# EAGLE design Telemetry receiver (EAGLE 8.0.1)
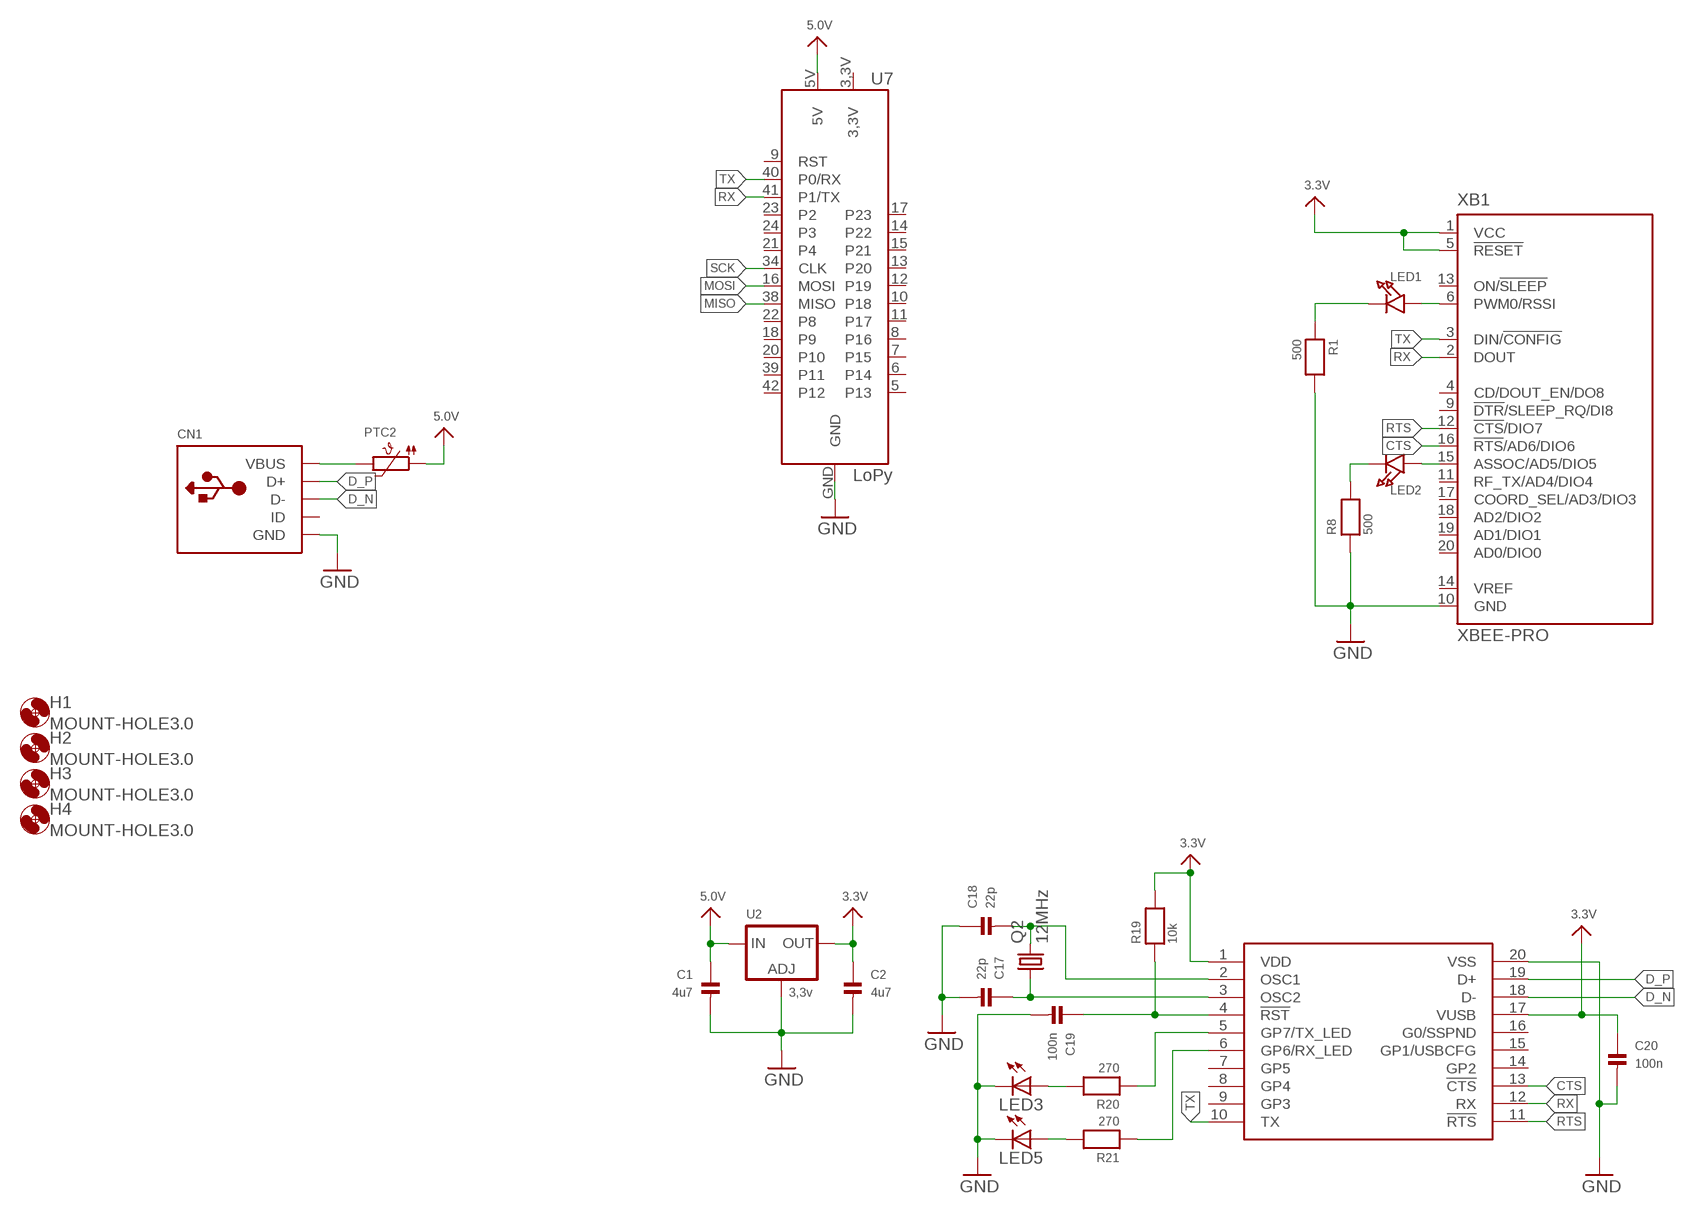
[diagram p0: schematic, sheet 1]

## Parts
C1  4u7  CAP_CERAMIC_0805  [_0805]
C2  4u7  CAP_CERAMIC_0805  [_0805]
C17  22p  CAP_CERAMIC_0603  [_0603]
C18  22p  CAP_CERAMIC_0603  [_0603]
C19  100n  CAP_CERAMIC_0603  [_0603]
C20  100n  CAP_CERAMIC_0603  [_0603]
CN1  USBMINIBLARGE  [USB-MINIB_LARGER]
H1  MOUNT-HOLE3.0  [3,0]
H2  MOUNT-HOLE3.0  [3,0]
H3  MOUNT-HOLE3.0  [3,0]
H4  MOUNT-HOLE3.0  [3,0]
LED1  LED1206  [CHIPLED_1206]
LED2  LED1206  [CHIPLED_1206]
LED3  LEDCHIPLED_0805  [CHIPLED_0805]
LED5  LEDCHIPLED_0805  [CHIPLED_0805]
PTC2  PTC1812  [PTC1812]
Q2  12MHz  CRYSTALHC49S  [HC49/S]
R1  500  RESISTOR_0603  [_0603]
R8  500  RESISTOR_0603  [_0603]
R19  10k  RESISTOR_0603  [_0603]
R20  270  RESISTOR_0603  [_0603]
R21  270  RESISTOR_0603  [_0603]
U2  3,3v  LM1117SOT223-REFLOW  [SOT223-R]
U7  LoPy  LOPY  [LOPY]
U$24  MCP2200  [SO20L]
XB1  XBEE-PRO  [XBEE-PRO]

## Nets
3.3V: C2.1 C20.1 R19.2 U2.2(OUT) U$24.1(VDD) U$24.17(VUSB) XB1.1(VCC) XB1.5(!RESET)
5.0V: C1.1 PTC2.P$1 U2.3(IN) U7.5V
CTS: U$24.13(!CTS) XB1.16(!RTS!/AD6/DIO6)
D_N: CN1.D- U$24.18(D-)
D_P: CN1.D+ U$24.19(D+)
GND: C1.2 C2.2 C17.2 C18.1 C19.2 C20.2 CN1.GND LED3.C LED5.C R1.2 R8.1 U2.1(ADJ) U7.GND U$24.20(VSS) XB1.10(GND)
MISO: U7.38(MISO)
MOSI: U7.16(MOSI)
N$1: CN1.VBUS PTC2.P$2
N$2: LED1.A XB1.6(PWM0/RSSI)
N$3: LED1.C R1.1
N$5: LED2.A XB1.15(ASSOC/AD5/DIO5)
N$6: LED2.C R8.2
N$26: C18.2 Q2.2 U$24.2(OSC1)
N$27: C17.1 Q2.1 U$24.3(OSC2)
N$29: R21.1 U$24.6(GP6/RX_LED)
N$36: R20.1 U$24.5(GP7/TX_LED)
N$43: C19.1 R19.1 U$24.4(!RST)
N$46: LED3.A R20.2
N$47: LED5.A R21.2
RTS: U$24.11(!RTS) XB1.12(!CTS!/DIO7)
RX: U7.41(P1/TX) U$24.12(RX) XB1.2(DOUT)
SCK: U7.34(CLK)
TX: U7.40(P0/RX) U$24.10(TX) XB1.3(DIN/!CONFIG)
Unconnected: CN1.ID U7.3,3V U7.5(P13) U7.6(P14) U7.7(P15) U7.8(P16) U7.9(RST) U7.10(P18) U7.11(P17) U7.12(P19) U7.13(P20) U7.14(P22) U7.15(P21) U7.17(P23) U7.18(P9) U7.20(P10) U7.21(P4) U7.22(P8) U7.23(P2) U7.24(P3) U7.39(P11) U7.42(P12) U$24.7(GP5) U$24.8(GP4) U$24.9(GP3) U$24.14(GP2) U$24.15(GP1/USBCFG) U$24.16(G0/SSPND) XB1.4(CD/DOUT_EN/DO8) XB1.9(!DTR!/SLEEP_RQ/DI8) XB1.11(RF_TX/AD4/DIO4) XB1.13(ON/!SLEEP) XB1.14(VREF) XB1.17(COORD_SEL/AD3/DIO3) XB1.18(AD2/DIO2) XB1.19(AD1/DIO1) XB1.20(AD0/DIO0)

## Library data of the parts
C1 C2 C17-C20 = microbuilder:CAP_CERAMIC: Ceramic Capacitors 0402 - 0402 Surface Mount Capacitors 16pF 50V 5% [Digikey: 445-4899-2-ND] 18pF 50V 5% [Digikey: 490-1281-2-ND] 22pF 50V 5% [Digikey: 490-1283-2-ND] 68pF 50V 5% [Digikey: 490-1289-2-ND] 0.1uF 10V 10% [Digikey: 490-1318-2-ND] 1.0uF 6.3V 10% [Digikey: 490-1320-2-ND] 0603 - 0603 Surface Mount Capacitors 16 pF 50V 5% [Digikey: 445-5051-2-ND] 22 pF 50V [Digikey: PCC220ACVTR-ND] 33 pF 50V 5% [Digikey: 490-1415-1-ND] 56pF 50V 5% [Digikey: 490-1421-1-ND] 220pF 50V 5% [Digikey: 445-1285-1-ND] 680 pF 50V 2200 pF 50V 5% C0G [Digikey: 445-1297-1-ND] 5600 pF 100V 5% X7R [Digikey: 478-3711-1-ND] 0.1 µF 25V 10% [Digikey: PCC2277TR-ND] 0.22 µF 16V 10% X7R [Digikey: 445-1318-1-ND] 1.0 µF 25V 10% [Digikey: 445-5146-2-ND] 0603 - RF Specific 3pF 250V +/-0.1pF RF [Digikey: 712-1347-1-ND] 18 pF 250V 5% [Digikey: 478-3505-1-ND or 712-1322-1-ND] 56 pF 250V 5% C0G RF [Digikey: 490-4867-1-ND] 68 pF 250V RF [Digikey: 490-4868-1-ND] 0805 - 0805 Surface Mount Capacitors 220 pF 250V 2% RF Ceramic Capacitor [Digikey: 712-1398-1-ND] 1000 pF 50V 2% NP0 Ceramic Capacitor [Digikey: 478-3760-1-ND] 0.1 µF 25V 10% Ceramic Capacitor [Digikey: PCC1828TR-ND] 1.0 µF 16V 10% Ceramic Capacitor[Digikey: 490-1691-2-ND] 10.0 µF 10V 10% Ceramic Capacitor[Digikey: 709-1228-1-ND] 10.0 uF 16V 10% Ceramic Capacitor [Digikey: 478-5165-2-ND] 47 uF 6.3V 20% Ceramic Capacitor [Digikey: 587-1779-1-ND or 399-5506-1-ND] 1206 - 1206 Surface Mount Capacitors 47uF 10V 20% Ceramic Capacitor [Digikey: 490-5528-1-ND or 399-5508-1-ND or 445-6010-1-ND] 100uF 6.3V -20%, +80% Y5V Ceramic Capacitor (Digikey: 490-4512-1-ND, Mouser: 81-GRM31CF50J107ZE1L)
CN1 = microbuilder:USB: USB Connectors USBMINIB - Surface Mount Female Mini-B USB Connector 4UConnector: 06564
H1-H4 = holes:MOUNT-HOLE: MOUNTING HOLE with drill center marker
LED1 LED2 = microbuilder:LED: LED
LED3 LED5 = adafruit:LED: LED
PTC2 = microbuilder:PTC: PTC (Resettable Fuse) 1206 Package 250mA PTC (16V Max, Time-to-Trip: 0.08s) - Digikey: F2110CT-ND 1210 Package 100mA PTC (30V Max, Time-to-Trip: 0.6s) - Digikey: MF-USMF010-2CT-ND 1812 Package 750mA PTC (24V Max, Time-to-Trip: 0.2s) - Digikey: MF-MSMF075/24-2CT-ND
Q2 = adafruit:CRYSTAL: CRYSTAL; OC_FARNELL: 1667008; OC_NEWARK: unknown
R1 R8 R19-R21 = microbuilder:RESISTOR: Resistors 0402 - 0402 Surface Mount Package 22 Ohm 1% 1/16W [Digikey: 311-22.0LRTR-ND] 33 Ohm 5% 1/16W 1.0K 5% 1/16W 1.5K 5% 1/16W 2.0K 1% 1/16W 10.0K 1% 1/16W [Digikey: 311-10.0KLRTR-ND] 10.0K 5% 1/16W [Digikey: RMCF0402JT10K0TR-ND] 12.1K 1% 1/16W [Digikey: 311-22.0LRTR-ND] 100.0K 5% 1/16W 0603 - 0603 Surface Mount Package 0 Ohm 1/10 Watt 1% Resistor 15 Ohm 1/10 Watt 1% Resistor 33 Ohm 1/10 Watt 1% Resistor 49.9 Ohm 1/10 Watt 1% Resistor 100 Ohm 1/10 Watt 1% Resistor 150 Ohm 1/10 Watt 1% Resistor 240 Ohm 1/10 Watt 1% Resistor 390 Ohm 1/10 Watt 1% Resistor 560 Ohm 1/10 Watt 1% Resistor 680 Ohm 1/10 Watt 1% Resistor 750 Ohm 1/10 Watt 1% Resistor 1.0K Ohm 1/10 Watt 1% Resistor 1.5K Ohm 1/10 Watt 1% Resistor 2.0K Ohm 1/10 Watt 1% Resistor 2.2K Ohm 1/10 Watt 1% Resistor 3.3K Ohm 1/10 Watt 1% Resistor 4.7K Ohm 1/10 Watt 1% Resistor 10.0K Ohm 1/10 Watt 1% Resistor 12.0K Ohm 1/10 Watt 1% Resistor 12.1K Ohm 1/10 Watt 1% Resistor 20.0K Ohm 1/10 Watt 1% Resistor 33.0K Ohm 1/10 Watt 1% Resistor 100.0K Ohm 1/10 Watt 1% Resistor 0805 - 0805 Surface Mount Package 0 Ohm 1/8 Watt 1% Resistor 33 Ohm 1/8 Watt 1% Resistor 100 Ohm 1/8 Watt 1% Resistor 150 Ohm 1/8 Watt 1% Resistor 200 Ohm 1/8 Watt 1% Resistor 240 Ohm 1/8 Watt 1% Resistor 330 Ohm 1/8 Watt 1% Resistor 390 Ohm 1/8 Watt 1% Resistor 470 Ohm 1/8 Watt 1% Resistor 1.0K Ohm 1/8 Watt 1% Resistor 1.5K Ohm 1/8 Watt 1% Resistor 2.0K Ohm 1/8 Watt 1% Resistor 4.7K Ohm 1/8 Watt 1% Resistor 5.1K Ohm 1/8 Watt 1% Resistor 5.6K Ohm 1/8 Watt 1% Resistor 10.0K Ohm 1/8 Watt 1% Resistor 22.0K Ohm 1/8 Watt 1% Resistor 33.0K Ohm 1/8 Watt 1% Resistor 100K Ohm 1/8 Watt 1% Resistor 1206 - 1206 Surface Mount Package 2012 - 2010 Surface Mount Package 0.11 Ohm 1/2 Watt 1% Resistor - Digikey: RHM.11UCT-ND
U2 = microbuilder:LM1117: LM1117 Voltage Regulator LM1117 Adjustable Voltage regulator [Digikey: LM1117IMP-ADJDKR-ND] LM1117 3.3V Voltage regulator [AP1117E33GDIDKR-ND] LM1117 5.0V Voltage regulator [AP1117E50GDIDKR-ND] SOT223-REFLOW - SOT223 package for solder paste/reflow ovens SOT223-WAVE - SOT223 package for hand-soldering (larger pads) Note: For the fixed-voltage regulators, simply set the ADJ pin to GND.
U7 = AAU-Racing:LOPY
U$24 = mcp2200:MCP2200: USB to serial converter by micreochip
XB1 = maxstream:XBEE: XBee (TM) /XBee-PRO(TM) OEM RF Modules Source: MaxStream, Inc. xbee_productmanual.pdf; MPN: XBP24-AWI-001; OC_FARNELL: 1337916; OC_NEWARK: 42M2667

## Board
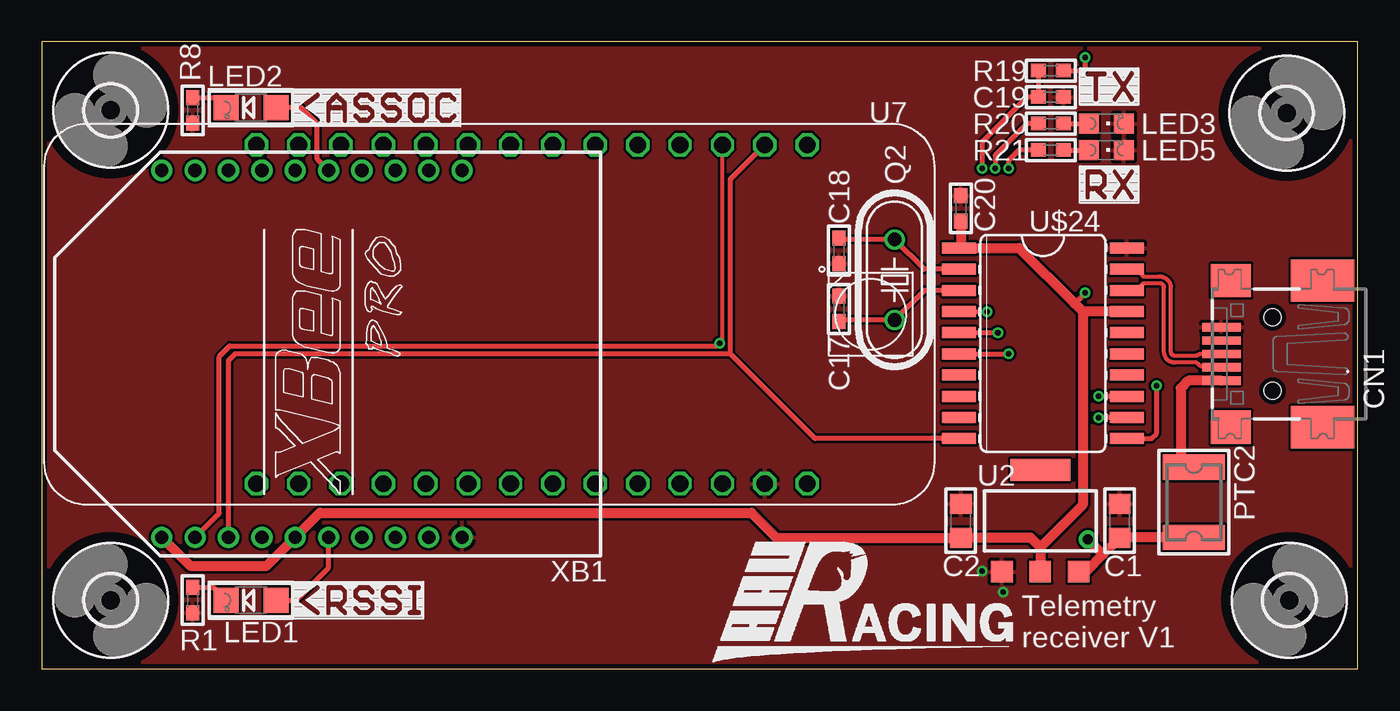
[diagram p1: board, top side]
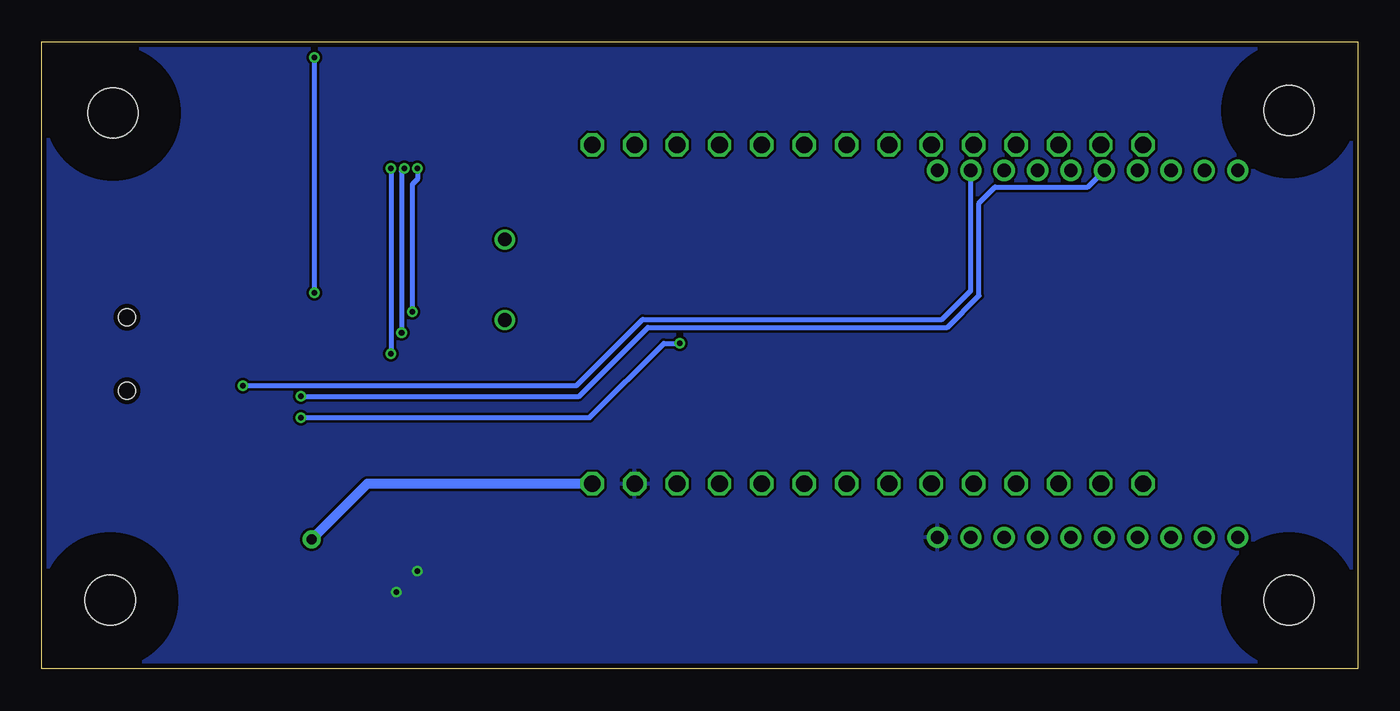
[diagram p2: board, bottom side, seen from below]

Size 78.88 x 37.61 mm. Coordinates in mm from the lower left corner, seen from the top.
Outline: 0,0 78.88,0 78.88,37.61 0,37.61 0,0
Copper layers (1*16): Top 0.035mm / dielectric 1.5mm / Bottom 0.035mm
Design rules "PCB-POOL Standard": minimum track width 0.15mm, minimum drill 0.3mm, track to track 0.15mm, track to pad 0.15mm, pad to pad 0.15mm, via to via 0.15mm, smd to smd 0.15mm, copper to edge 0.3mm, drill to drill 0.2mm, minimum pad ring 0.2mm, minimum via ring 0.15mm, stop-mask expansion 0.075mm, vias tented up to drill 0mil, thermal gap 0.2mm

### Footprints (pad centres in the part's own frame; a part is rotated, then mirrored left to right if it is on the bottom)
_0805 = smd 1.2 x 1.3: 1 -1.016,0; 2 1.016,0
_0603 = smd 0.9 x 0.8: 1 -0.762,0; 2 0.762,0
USB-MINIB_LARGER = smd 0.5 x 2.308: D+ 0,4.064; D- -0.8,4.064; GND 1.6,4.064; ID 0.8,4.064; VBUS -1.6,4.064 | smd 2.54 x 3.81: GND1 -4.4,-2; GND4 4.4,-2 | smd 2 x 2.4: GND2 -4.4,3.5; GND3 4.4,3.5 | hole 1: -2.2,1; 2.2,1
3,0 = hole 3: 0,0
CHIPLED_1206 = smd 1.5 x 1.5: A 0,-1.496; C 0,1.496
CHIPLED_0805 = smd 1.2 x 1.2: A 0,-1.05; C 0,1.05
PTC1812 = smd 1.5 x 3.7: P$1 -2.1,0; P$2 2.1,0
HC49/S = drill 0.813: 1 -2.413,0; 2 2.413,0
SOT223-R = smd 1.3 x 1.3: 1 -2.3,-3.05; 2 0,-3.05; 3 2.3,-3.05 | smd 3.6 x 1.3: 4 0,3.05
LOPY = drill 1 octagon: 3,3V 10.16,12.7; 5 10.16,-15.24; 5V 10.16,17.78; 6 10.16,-12.7; 7 10.16,-10.16; 8 10.16,-7.62; 9 -10.16,17.78; 10 10.16,-2.54; 11 10.16,-5.08; 12 10.16,0; 13 10.16,2.54; 14 10.16,7.62; 15 10.16,5.08; 16 -10.16,0; 17 10.16,10.16; 18 -10.16,-7.62; 20 -10.16,-10.16; 21 -10.16,5.08; 22 -10.16,-5.08; 23 -10.16,10.16; 24 -10.16,7.62; 34 -10.16,2.54; 38 -10.16,-2.54; 39 -10.16,-12.7; 40 -10.16,15.24; 41 -10.16,12.7; 42 -10.16,-15.24; GND 10.16,15.24
SO20L = smd 0.66 x 2.032: 1 -5.715,-5.029; 2 -4.445,-5.029; 3 -3.175,-5.029; 4 -1.905,-5.029; 5 -0.635,-5.029; 6 0.635,-5.029; 7 1.905,-5.029; 8 3.175,-5.029; 9 4.445,-5.029; 10 5.715,-5.029; 11 5.715,5.029; 12 4.445,5.029; 13 3.175,5.029; 14 1.905,5.029; 15 0.635,5.029; 16 -0.635,5.029; 17 -1.905,5.029; 18 -3.175,5.029; 19 -4.445,5.029; 20 -5.715,5.029
XBEE-PRO = drill 0.8 pad 1.27: 1 -11,9; 2 -11,7; 3 -11,5; 4 -11,3; 5 -11,1; 6 -11,-1; 7 -11,-3; 8 -11,-5; 9 -11,-7; 10 -11,-9; 11 11,-9; 12 11,-7; 13 11,-5; 14 11,-3; 15 11,-1; 16 11,1; 17 11,3; 18 11,5; 19 11,7; 20 11,9

### Placement (x,y rotation side)
C1  64.61,8.89 90 top
C2  55.09,8.89 90 top
C17  47.78,21.59 90 top
C18  47.78,25.08 90 top
C19  60.48,34.29 0 top
C20  55.09,27.62 90 top
CN1  74.77,18.89 90 top
H1  4.13,33.5 0 top
H2  4.13,4.13 90 top
H3  74.61,33.34 0 top
H4  74.77,4.13 0 top
LED1  12.54,4.13 90 top
LED2  12.54,33.66 90 top
LED3  63.82,32.7 270 top
LED5  63.82,31.11 270 top
PTC2  69.06,10 90 top
Q2  51.12,23.34 90 top
R1  9.05,4.13 270 top
R8  9.05,33.5 90 top
R19  60.48,35.88 0 top
R20  60.48,32.7 0 top
R21  60.48,31.11 0 top
U2  59.85,8.89 0 top
U7  28.1,21.27 270 top
U$24  60.01,19.53 270 top
XB1  16.19,18.89 90 top

### Tracks (layer width: path | path; a pad name or v marks a point on that pad's centre or on a via)
3.3V  (via drill 0.33)
  Top 0.305: v62.55,22.54 61.91,21.91 | R19.2 62.39,35.88 62.55,36.04 v62.55,36.67
  Top 0.61: 59.85,7.3 U2.2 | 59.85,7.3 59.28,7.87 C2.1 44.04,7.87 42.55,9.37 16.67,9.37 XB1.5 13.49,6.19 8.89,6.19 XB1.1 | U$24.17 62.39,21.43 | 62.39,21.43 61.91,21.91 58.58,25.24 U$24.1 55.09,25.35 C20.1 | 62.39,21.43 62.39,9.84 59.85,7.3
  Bottom 0.305: v62.55,36.67 v62.55,22.54
5.0V  (via drill 0.6)
  Top 0.61: PTC2.P$1 64.64,7.9 C1.1 63.61,6.87 | U2.3 62.58,5.84 63.61,6.87 | v62.71,7.78 63.61,6.87
  Bottom 0.61: U7.5V 59.37,11.11 v62.71,7.78
CTS  (via drill 0.33)
  Top 0.305: U$24.13 v63.34,16.35
  Bottom 0.305: v63.34,16.35 46.67,16.35 42.55,20.48 24.61,20.48 22.7,22.38 22.7,27.94 21.75,28.89 16.19,28.89 XB1.16
D_N
  Top 0.254: U$24.18 65.34,22.7 arc45 65.79,22.89 66.04,23.13 66.99,23.13 arc-90 67.27,22.86 67.27,19.01 arc90 67.9,18.37 69.22,18.37 69.31,18.28 arc45 69.76,18.09 CN1.D-
D_P
  Top 0.254: U$24.19 65.34,23.97 arc-45 65.79,23.79 66.04,23.54 66.99,23.54 arc-90 67.67,22.86 67.67,19.05 arc90 67.94,18.78 69.22,18.78 arc-45 69.49,18.89 CN1.D+
GND  (via drill 0.33)
  other vias: 57.63,4.6 56.36,5.87
  pour Bottom: 0,0 78.9,0 78.9,37.94 0,37.94
  pour Top (rank 2): 0,0 0,37.62 78.9,37.62 78.9,0
N$1
  Top 0.61: CN1.VBUS 68.73,17.29 68.26,16.83 68.26,12.54 68.1,12.38 68.78,12.38 PTC2.P$2
N$2
  Top 0.305: LED1.A 15.24,4.13 17.19,6.08 XB1.6
N$3
  Top 0.305: R1.1 10.28,4.89 LED1.C
N$5
  Top 0.305: XB1.15 16.51,30.57 16.51,32.7 15.56,33.66 LED2.A
N$6
  Top 0.305: R8.2 10.44,34.26 LED2.C
N$26
  Top 0.305: U$24.2 52.9,23.97 Q2.2 47.88,25.75 C18.2
N$27
  Top 0.305: U$24.3 52.9,22.7 Q2.1 47.88,20.92 C17.1
N$29  (via drill 0.33)
  Top 0.305: U$24.6 v57.94,18.89 | R21.1 58.58,31.11 57.94,30.48 v57.94,30
  Bottom 0.305: v57.94,30 v57.94,18.89
N$36  (via drill 0.33)
  Top 0.305: U$24.5 v57.31,20.16 | R20.1 59.05,32.7 57.15,30.8 v57.15,30
  Bottom 0.305: v57.15,30 57.31,29.84 v57.31,20.16
N$43  (via drill 0.33)
  Top 0.305: U$24.4 v56.67,21.43 | R19.1 C19.1 59.05,34.29 56.36,31.59 v56.36,30
  Bottom 0.305: v56.36,30 56.36,29.37 56.67,29.05 v56.67,21.43
N$46
  Top 0.305: R20.2 LED3.A
N$47
  Top 0.305: R21.2 LED5.A
RTS  (via drill 0.33)
  Top 0.305: U$24.11 66.52,13.81 66.83,14.13 v66.83,16.99
  Bottom 0.305: v66.83,16.99 46.83,16.99 42.86,20.95 24.92,20.95 23.19,22.69 XB1.12
RX  (via drill 0.33)
  Top 0.254: v40.64,19.53 40.8,19.68 U7.41
  Top 0.305: XB1.2 10.64,9.34 10.64,18.73 11.27,19.37 40.48,19.37 v40.64,19.53 | U$24.12 v63.34,15.08
  Bottom 0.305: v63.34,15.08 46.04,15.08 41.59,19.53 v40.64,19.53
TX
  Top 0.305: XB1.3 11.19,18.5 11.59,18.89 41.27,18.89 | U7.40 41.27,29.37 41.27,18.89 | U$24.10 46.35,13.81 41.27,18.89

### Text on the board
tPlace: Telemetry / receiver V1